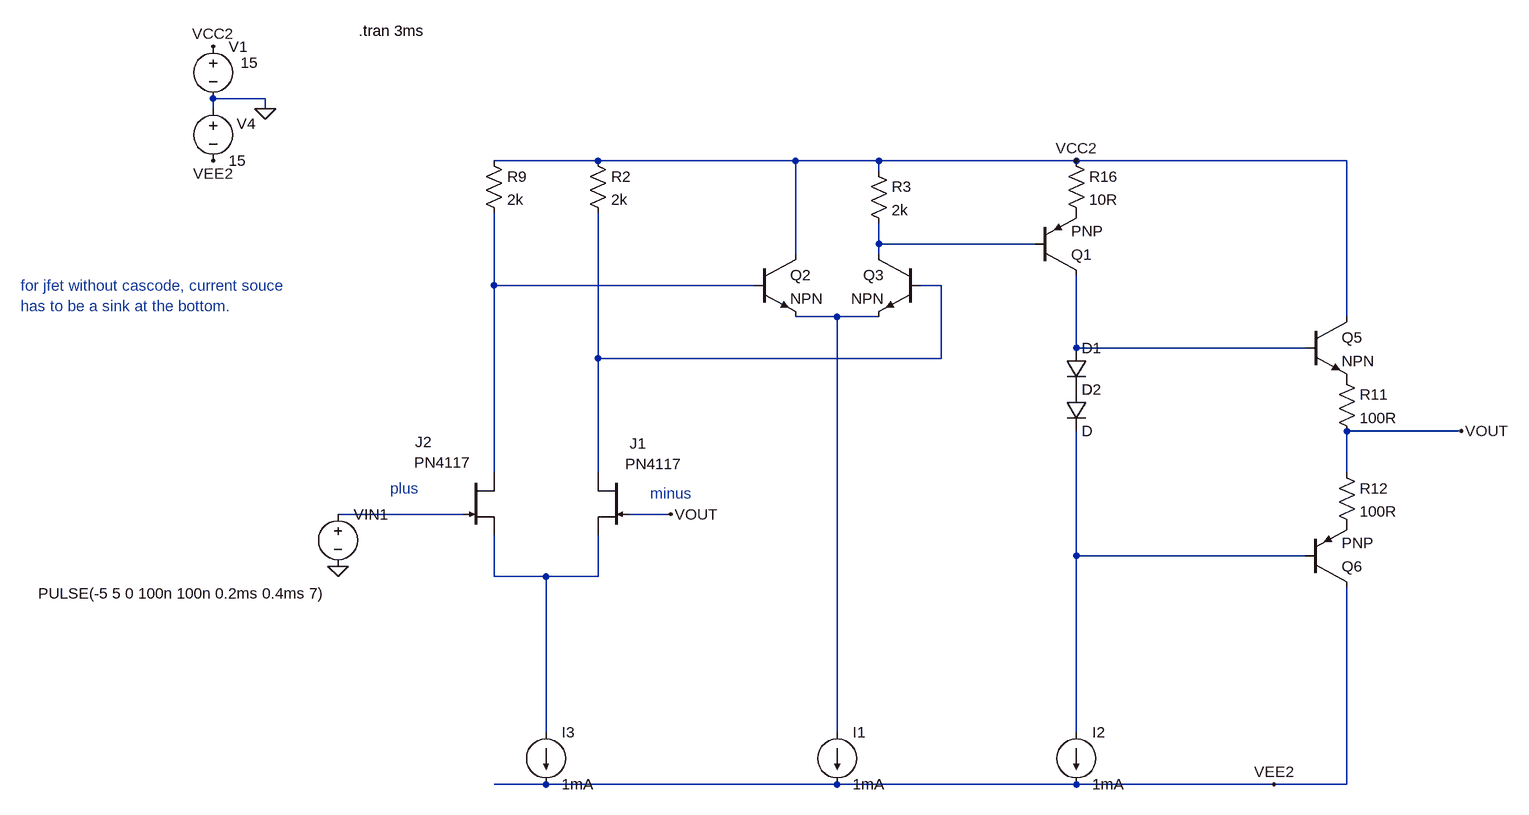
[diagram p0: schematic Draft46.asc]
Draft46.asc, the LTspice schematic file:
Version 4
SHEET 1 1664 952
WIRE -256 -288 -336 -288
WIRE -336 -272 -336 -288
WIRE -256 -272 -256 -288
WIRE 256 -192 96 -192
WIRE 560 -192 256 -192
WIRE 688 -192 560 -192
WIRE 992 -192 688 -192
WIRE 1408 -192 992 -192
WIRE 688 -176 688 -192
WIRE 688 -64 688 -96
WIRE 928 -64 688 -64
WIRE 560 -48 560 -192
WIRE 688 -48 688 -64
WIRE 96 0 96 -112
WIRE 496 0 96 0
WIRE 784 0 752 0
WIRE 624 48 560 48
WIRE 688 48 624 48
WIRE 1408 48 1408 -192
WIRE 992 96 992 -16
WIRE 1344 96 992 96
WIRE 256 112 256 -112
WIRE 784 112 784 0
WIRE 784 112 256 112
WIRE 1584 224 1408 224
WIRE 96 288 96 0
WIRE 256 288 256 112
WIRE 1408 288 1408 224
WIRE 48 352 -144 352
WIRE 368 352 304 352
WIRE 992 416 992 224
WIRE 1344 416 992 416
WIRE 96 448 96 384
WIRE 176 448 96 448
WIRE 256 448 256 384
WIRE 256 448 176 448
WIRE 176 688 176 448
WIRE 624 688 624 48
WIRE 992 688 992 416
WIRE 176 768 96 768
WIRE 624 768 176 768
WIRE 992 768 624 768
WIRE 1296 768 992 768
WIRE 1408 768 1408 464
WIRE 1408 768 1296 768
FLAG -256 -272 0
FLAG -336 -368 VCC2
FLAG -336 -192 VEE2
FLAG 992 -192 VCC2
FLAG 1296 768 VEE2
FLAG 1584 224 VOUT
FLAG -144 432 0
FLAG 368 352 VOUT
SYMBOL voltage -336 -384 R0
WINDOW 123 0 0 Left 0
WINDOW 39 0 0 Left 0
WINDOW 3 42 41 Left 2
SYMATTR Value 15
SYMATTR InstName V1
SYMBOL voltage -336 -288 R0
WINDOW 123 0 0 Left 0
WINDOW 39 0 0 Left 0
WINDOW 0 36 39 Left 2
SYMATTR InstName V4
SYMATTR Value 15
SYMBOL npn 1344 48 R0
SYMATTR InstName Q5
SYMBOL res 1392 128 R0
SYMATTR InstName R11
SYMATTR Value 100R
SYMBOL res 1392 272 R0
SYMATTR InstName R12
SYMATTR Value 100R
SYMBOL pnp 1344 464 M180
SYMATTR InstName Q6
SYMBOL voltage -144 336 R0
WINDOW 123 0 0 Left 0
WINDOW 39 0 0 Left 0
WINDOW 3 -461 138 Left 2
SYMATTR Value PULSE(-5 5 0 100n 100n 0.2ms 0.4ms 7)
SYMATTR InstName VIN1
SYMBOL res 80 -208 R0
SYMATTR InstName R9
SYMATTR Value 2k
SYMBOL res 976 -208 R0
SYMATTR InstName R16
SYMATTR Value 10R
SYMBOL diode 976 96 R0
SYMATTR InstName D1
SYMBOL diode 976 160 R0
SYMATTR InstName D2
SYMBOL current 992 688 R0
WINDOW 123 0 0 Left 0
WINDOW 39 0 0 Left 0
SYMATTR InstName I2
SYMATTR Value 1mA
SYMBOL njf 48 288 R0
WINDOW 0 257 -45 Left 2
WINDOW 3 -75 -16 Left 2
SYMATTR InstName J1
SYMATTR Value PN4117
SYMBOL njf 304 288 M0
WINDOW 0 329 -47 Right 2
WINDOW 3 6 -13 Right 2
SYMATTR InstName J2
SYMATTR Value PN4117
SYMBOL current 176 688 R0
WINDOW 123 0 0 Left 0
WINDOW 39 0 0 Left 0
SYMATTR InstName I3
SYMATTR Value 1mA
SYMBOL pnp 928 -16 M180
SYMATTR InstName Q1
SYMBOL npn 496 -48 R0
SYMATTR InstName Q2
SYMBOL npn 752 -48 M0
SYMATTR InstName Q3
SYMBOL current 624 688 R0
WINDOW 123 0 0 Left 0
WINDOW 39 0 0 Left 0
SYMATTR InstName I1
SYMATTR Value 1mA
SYMBOL res 240 -208 R0
SYMATTR InstName R2
SYMATTR Value 2k
SYMBOL res 672 -192 R0
SYMATTR InstName R3
SYMATTR Value 2k
TEXT -112 -392 Left 2 !.tran 3ms
TEXT 336 320 Left 2 ;minus
TEXT -632 0 Left 2 ;for jfet without cascode, current souce \nhas to be a sink at the bottom.
TEXT -64 312 Left 2 ;plus

The netlist it stands for:
* Draft46.asc
V1 VCC2 0 15
V4 0 VEE2 15
Q5 VCC2 N005 P001 0 NPN
R11 P001 VOUT 100R
R12 VOUT P002 100R
Q6 VEE2 N007 P002 0 PNP
VIN1 N006 0 PULSE(-5 5 0 100n 100n 0.2ms 0.4ms 7)
R9 VCC2 N002 2k
R16 VCC2 P003 10R
D1 N005 P004 D
D2 P004 N007 D
I2 N007 VEE2 1mA
J1 N002 N006 N008 PN4117
J2 N003 VOUT N008 PN4117
I3 N008 VEE2 1mA
Q1 N005 N001 P003 0 PNP
Q2 VCC2 N002 N004 0 NPN
Q3 N001 N003 N004 0 NPN
I1 N004 VEE2 1mA
R2 VCC2 N003 2k
R3 VCC2 N001 2k
.model D D
.lib standard.dio
.model NPN NPN
.model PNP PNP
.lib standard.bjt
.model NJF NJF
.model PJF PJF
.lib standard.jft
.tran 3ms
* minus
* for jfet without cascode, current souce
* has to be a sink at the bottom.
* plus
.backanno
.end